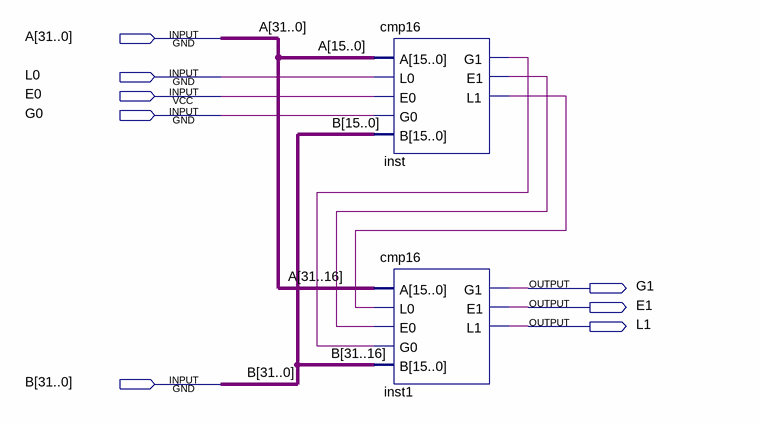
[diagram p0: schematic sheet]
// Quartus schematic cmp32.bdf as structural Verilog: 2 symbols, 8 pins
module cmp32 (
  input  [31:0] A,
  input  L0,
  input  E0,
  input  G0,
  input  [31:0] B,
  output G1,
  output E1,
  output L1
);

  wire inst_e1, inst_g1, inst_l1;

  cmp16 inst (.A(A[15:0]), .L0(L0), .E0(E0), .G0(G0), .B(B[15:0]), .G1(inst_g1), .E1(inst_e1), .L1(inst_l1));
  cmp16 inst1 (.A(A[31:16]), .L0(inst_l1), .E0(inst_e1), .G0(inst_g1), .B(B[31:16]), .G1(G1), .E1(E1), .L1(L1));
endmodule
